# Altium schematic sheet AD9361 RF Frontend.SchDoc
size A4
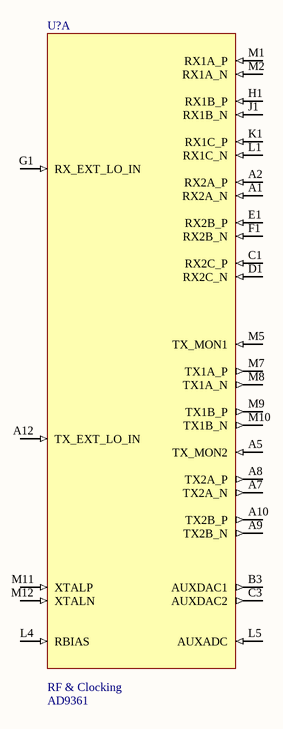
[diagram p0: AD9361 RF Frontend.SchDoc]

## Parts
U?  AD9361  [BGA144C80P12X12_1000X1000X170]  (part A of 4)

## Nets

Not connected (* = marked no-connect by the designer): U? A1(RX2A_N) A2(RX2A_P) A5(TX_MON2) A7(TX2A_N) A8(TX2A_P) A9(TX2B_N) A10(TX2B_P) A12(TX_EXT_LO_IN) B3(AUXDAC1) C1(RX2C_P) C3(AUXDAC2) D1(RX2C_N) E1(RX2B_P) F1(RX2B_N) G1(RX_EXT_LO_IN) H1(RX1B_P) J1(RX1B_N) K1(RX1C_P) L1(RX1C_N) L4(RBIAS) L5(AUXADC) M1(RX1A_P) M2(RX1A_N) M5(TX_MON1) M7(TX1A_P) M8(TX1A_N) M9(TX1B_P) M10(TX1B_N) M11(XTALP) M12(XTALN)

## Notes on the sheet
- Title
- Size:
- Date:
- A3
- Drawn by:
- Time:
- Revision:
- Sheet
- of
- File:
- (in symbol AD9361, part A) RF & Clocking

## Library data of the parts
U? = AD9361: RF Agile Transceiver 2Tx x 2Rx